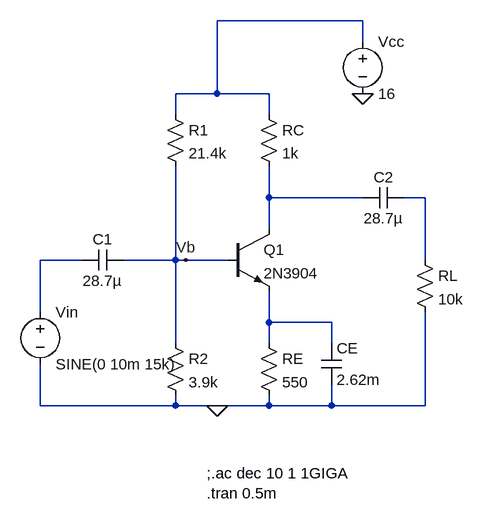
[diagram p0: schematic RC_coupled_amp.asc]
RC_coupled_amp.asc, the LTspice schematic file:
Version 4
SHEET 1 880 684
WIRE 624 -48 400 -48
WIRE 624 -16 624 -48
WIRE 400 64 400 -48
WIRE 400 64 336 64
WIRE 480 64 400 64
WIRE 336 96 336 64
WIRE 480 96 480 64
WIRE 480 224 480 176
WIRE 624 224 480 224
WIRE 720 224 688 224
WIRE 480 272 480 224
WIRE 192 320 128 320
WIRE 336 320 336 176
WIRE 336 320 256 320
WIRE 352 320 336 320
WIRE 416 320 352 320
WIRE 720 320 720 224
WIRE 128 400 128 320
WIRE 480 416 480 368
WIRE 576 416 480 416
WIRE 336 448 336 320
WIRE 480 448 480 416
WIRE 576 448 576 416
WIRE 128 544 128 480
WIRE 336 544 336 528
WIRE 336 544 128 544
WIRE 400 544 336 544
WIRE 480 544 480 528
WIRE 480 544 400 544
WIRE 576 544 576 512
WIRE 576 544 480 544
WIRE 720 544 720 400
WIRE 720 544 576 544
FLAG 400 544 0
FLAG 624 64 0
FLAG 352 320 Vb
SYMBOL res 320 80 R0
SYMATTR InstName R1
SYMATTR Value 21.4k
SYMBOL res 320 432 R0
SYMATTR InstName R2
SYMATTR Value 3.9k
SYMBOL res 464 80 R0
SYMATTR InstName RC
SYMATTR Value 1k
SYMBOL res 464 432 R0
SYMATTR InstName RE
SYMATTR Value 550
SYMBOL npn 416 272 R0
SYMATTR InstName Q1
SYMATTR Value 2N3904
SYMBOL cap 256 304 R90
WINDOW 0 0 32 VBottom 2
WINDOW 3 32 32 VTop 2
SYMATTR InstName C1
SYMATTR Value 28.7µ
SYMBOL cap 688 208 R90
WINDOW 0 0 32 VBottom 2
WINDOW 3 32 32 VTop 2
SYMATTR InstName C2
SYMATTR Value 28.7µ
SYMBOL cap 560 448 R0
SYMATTR InstName CE
SYMATTR Value 2.62m
SYMBOL res 704 304 R0
SYMATTR InstName RL
SYMATTR Value 10k
SYMBOL voltage 128 384 R0
SYMATTR InstName Vin
SYMATTR Value SINE(0 10m 15k)
SYMBOL voltage 624 -32 R0
SYMATTR InstName Vcc
SYMATTR Value 16
TEXT 384 648 Left 2 !;.ac dec 10 1 1GIGA\n.tran 0.5m

The netlist it stands for:
* RC_coupled_amp.asc
R1 N001 Vb 21.4k
R2 Vb 0 3.9k
RC N001 N002 1k
RE N005 0 550
Q1 N002 Vb N005 0 2N3904
C1 Vb N004 28.7µ
C2 N003 N002 28.7µ
CE N005 0 2.62m
RL N003 0 10k
Vin N004 0 SINE(0 10m 15k)
Vcc N001 0 16
.model NPN NPN
.model PNP PNP
.lib standard.bjt
;.ac dec 10 1 1GIGA
.tran 0.5m
.backanno
.end